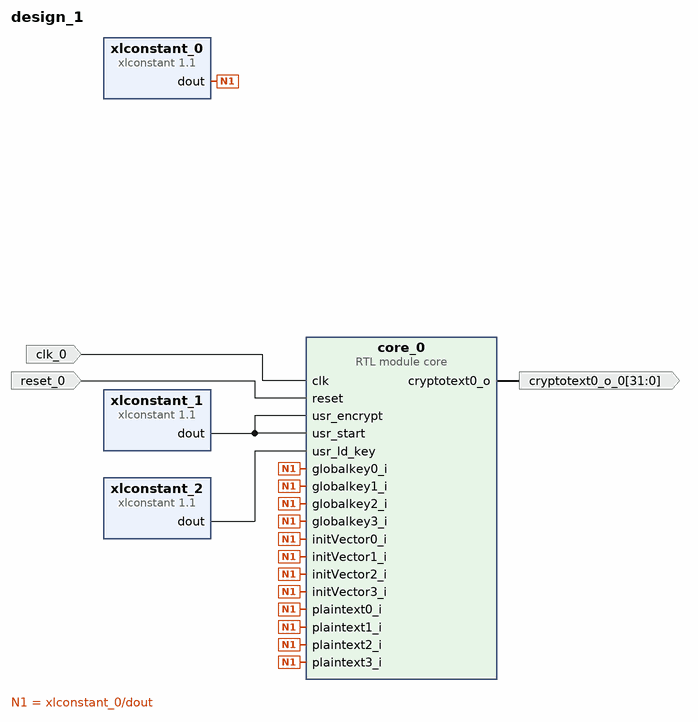
[diagram p0: block diagram of the top level]
# Vivado block design design_1, xc7z010clg400-1, Vivado 2022.2
create_bd_design design_1

create_bd_port -dir I -type clk clk_0
create_bd_port -dir I -type rst reset_0
create_bd_port -dir O -from 31 -to 0 cryptotext0_o_0

create_bd_cell -type ip -vlnv xilinx.com:ip:xlconstant:1.1 xlconstant_0
set_property -dict {CONFIG.CONST_VAL 0 CONFIG.CONST_WIDTH 32} [get_bd_cells xlconstant_0]
create_bd_cell -type ip -vlnv xilinx.com:ip:xlconstant:1.1 xlconstant_1
create_bd_cell -type ip -vlnv xilinx.com:ip:xlconstant:1.1 xlconstant_2
set_property -dict {CONFIG.CONST_VAL 0} [get_bd_cells xlconstant_2]
create_bd_cell -type module -reference core core_0

# ---- connections ----

connect_bd_net -net clk_0_1 [get_bd_ports clk_0] [get_bd_pins core_0/clk]
connect_bd_net [get_bd_pins core_0/cryptotext0_o] [get_bd_ports cryptotext0_o_0]
connect_bd_net -net reset_0_1 [get_bd_ports reset_0] [get_bd_pins core_0/reset]
connect_bd_net [get_bd_pins xlconstant_0/dout] \
  [get_bd_pins core_0/plaintext3_i] [get_bd_pins core_0/plaintext2_i] [get_bd_pins core_0/plaintext1_i] \
  [get_bd_pins core_0/plaintext0_i] [get_bd_pins core_0/globalkey3_i] [get_bd_pins core_0/globalkey2_i] \
  [get_bd_pins core_0/globalkey1_i] [get_bd_pins core_0/globalkey0_i] [get_bd_pins core_0/initVector3_i] \
  [get_bd_pins core_0/initVector2_i] [get_bd_pins core_0/initVector1_i] [get_bd_pins core_0/initVector0_i]
connect_bd_net [get_bd_pins xlconstant_1/dout] [get_bd_pins core_0/usr_start] [get_bd_pins core_0/usr_encrypt]
connect_bd_net [get_bd_pins xlconstant_2/dout] [get_bd_pins core_0/usr_ld_key]

validate_bd_design
save_bd_design
